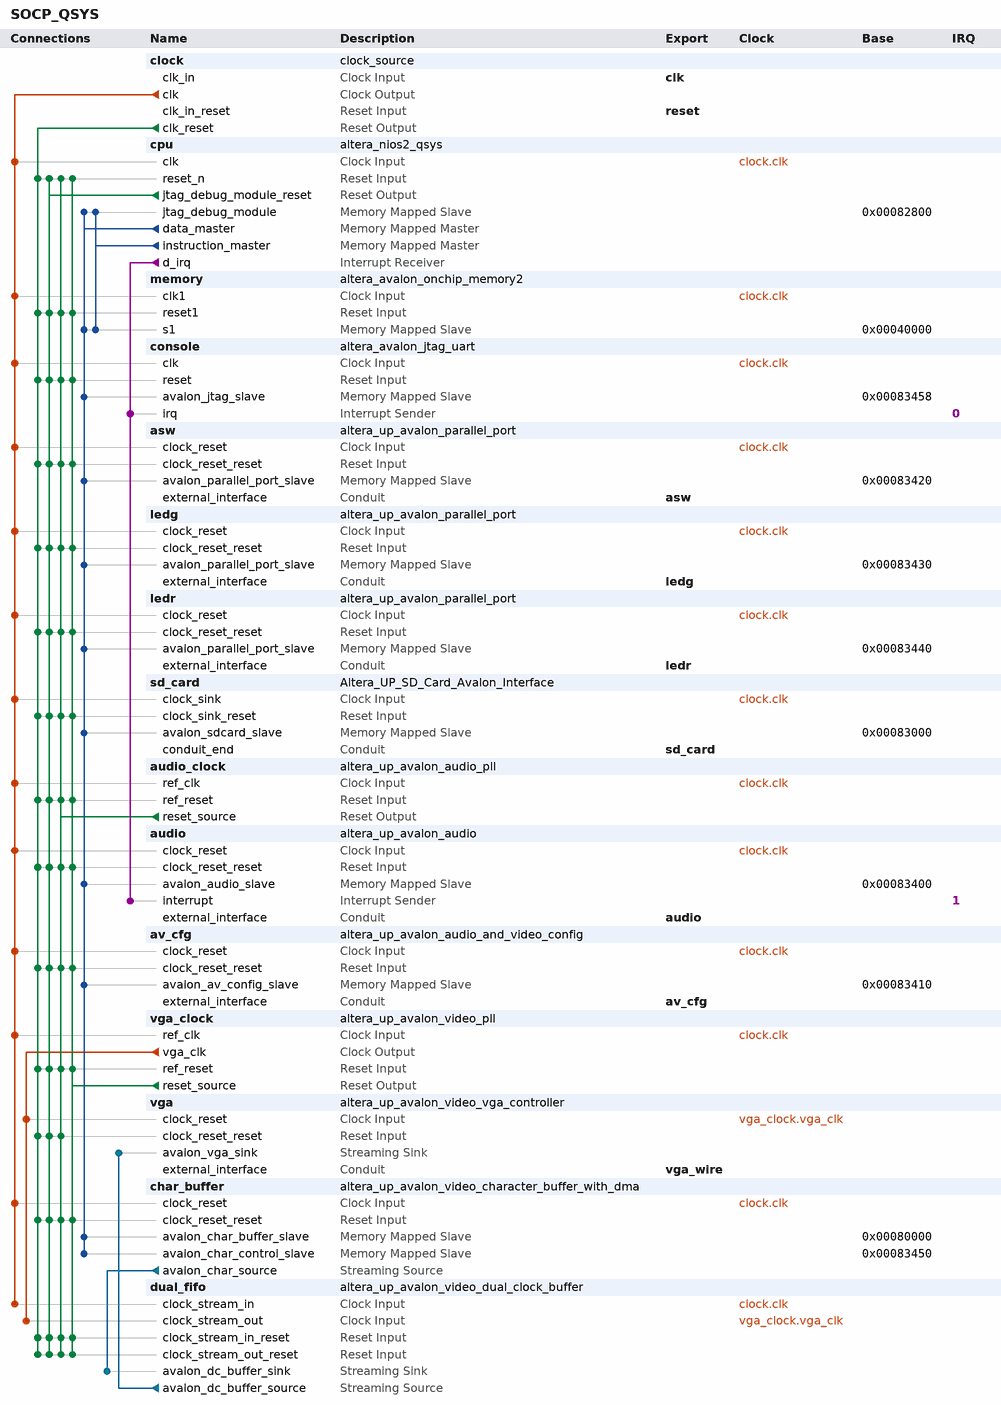
[diagram p0: system contents]
# Platform Designer (Qsys) system SOCP_QSYS, Cyclone IV E EP4CE115F29C7
# Parameters at their usual value, and those the tool derives, are not listed.
package require -exact qsys 13.1
create_system SOCP_QSYS
set_project_property DEVICE_FAMILY {Cyclone IV E}
set_project_property DEVICE EP4CE115F29C7

add_instance clock clock_source 14.0
set_instance_parameter_value clock clockFrequency 50000000

add_instance cpu altera_nios2_qsys 14.0
set_instance_parameter_value cpu resetrequest_enabled true
set_instance_parameter_value cpu resetSlave memory.s1
set_instance_parameter_value cpu mmu_TLBMissExcSlave None
set_instance_parameter_value cpu exceptionSlave memory.s1
set_instance_parameter_value cpu breakSlave cpu.jtag_debug_module
set_instance_parameter_value cpu impl Fast
set_instance_parameter_value cpu icache_size 4096

add_instance memory altera_avalon_onchip_memory2 14.0
set_instance_parameter_value memory dataWidth 32
set_instance_parameter_value memory dualPort false
set_instance_parameter_value memory initMemContent true
set_instance_parameter_value memory initializationFileName onchip_mem.hex
set_instance_parameter_value memory memorySize 196608

add_instance console altera_avalon_jtag_uart 14.0
set_instance_parameter_value console simInteractiveOptions NO_INTERACTIVE_WINDOWS

add_instance asw altera_up_avalon_parallel_port 13.1
set_instance_parameter_value asw board DE2-115
set_instance_parameter_value asw preset {Slider Switches}
set_instance_parameter_value asw capture false
set_instance_parameter_value asw edge Rising
set_instance_parameter_value asw irq false

add_instance ledg altera_up_avalon_parallel_port 13.1
set_instance_parameter_value ledg board DE2-115
set_instance_parameter_value ledg preset LEDs
set_instance_parameter_value ledg capture false
set_instance_parameter_value ledg edge Rising
set_instance_parameter_value ledg irq false

add_instance ledr altera_up_avalon_parallel_port 13.1
set_instance_parameter_value ledr board DE2-115
set_instance_parameter_value ledr preset LEDs
set_instance_parameter_value ledr leds Red
set_instance_parameter_value ledr capture false
set_instance_parameter_value ledr edge Rising
set_instance_parameter_value ledr irq false

add_instance sd_card Altera_UP_SD_Card_Avalon_Interface 13.1

add_instance audio_clock altera_up_avalon_audio_pll 13.1
set_instance_parameter_value audio_clock gui_refclk 50.0

add_instance audio altera_up_avalon_audio 13.1
set_instance_parameter_value audio avalon_bus_type {Memory Mapped}
set_instance_parameter_value audio audio_in true
set_instance_parameter_value audio dw 32

add_instance av_cfg altera_up_avalon_audio_and_video_config 13.1
set_instance_parameter_value av_cfg board DE2-115
set_instance_parameter_value av_cfg audio_in {Line In to ADC}
set_instance_parameter_value av_cfg dac_enable false
set_instance_parameter_value av_cfg line_in_bypass true
set_instance_parameter_value av_cfg bit_length 32
set_instance_parameter_value av_cfg sampling_rate {48 kHz}

add_instance vga_clock altera_up_avalon_video_pll 13.1
set_instance_parameter_value vga_clock gui_refclk 50.0
set_instance_parameter_value vga_clock camera {5MP Digital Camera}
set_instance_parameter_value vga_clock lcd {7" LCD on VEEK-MT and MTL Module}

add_instance vga altera_up_avalon_video_vga_controller 13.1
set_instance_parameter_value vga board DE2-115
set_instance_parameter_value vga resolution {VGA 640x480}

add_instance char_buffer altera_up_avalon_video_character_buffer_with_dma 13.1
set_instance_parameter_value char_buffer enable_transparency false

add_instance dual_fifo altera_up_avalon_video_dual_clock_buffer 13.1
set_instance_parameter_value dual_fifo color_bits 10

# connections
add_connection clock.clk asw.clock_reset clock
add_connection clock.clk audio.clock_reset clock
add_connection clock.clk audio_clock.ref_clk clock
add_connection clock.clk av_cfg.clock_reset clock
add_connection clock.clk char_buffer.clock_reset clock
add_connection clock.clk console.clk clock
add_connection clock.clk cpu.clk clock
add_connection clock.clk dual_fifo.clock_stream_in clock
add_connection clock.clk ledg.clock_reset clock
add_connection clock.clk ledr.clock_reset clock
add_connection clock.clk memory.clk1 clock
add_connection clock.clk sd_card.clock_sink clock
add_connection clock.clk vga_clock.ref_clk clock
add_connection vga_clock.vga_clk dual_fifo.clock_stream_out clock
add_connection vga_clock.vga_clk vga.clock_reset clock
add_connection audio_clock.reset_source asw.clock_reset_reset reset
add_connection audio_clock.reset_source audio.clock_reset_reset reset
add_connection audio_clock.reset_source audio_clock.ref_reset reset
add_connection audio_clock.reset_source av_cfg.clock_reset_reset reset
add_connection audio_clock.reset_source char_buffer.clock_reset_reset reset
add_connection audio_clock.reset_source console.reset reset
add_connection audio_clock.reset_source cpu.reset_n reset
add_connection audio_clock.reset_source dual_fifo.clock_stream_in_reset reset
add_connection audio_clock.reset_source dual_fifo.clock_stream_out_reset reset
add_connection audio_clock.reset_source ledg.clock_reset_reset reset
add_connection audio_clock.reset_source ledr.clock_reset_reset reset
add_connection audio_clock.reset_source memory.reset1 reset
add_connection audio_clock.reset_source sd_card.clock_sink_reset reset
add_connection audio_clock.reset_source vga.clock_reset_reset reset
add_connection audio_clock.reset_source vga_clock.ref_reset reset
add_connection clock.clk_reset asw.clock_reset_reset reset
add_connection clock.clk_reset audio.clock_reset_reset reset
add_connection clock.clk_reset audio_clock.ref_reset reset
add_connection clock.clk_reset av_cfg.clock_reset_reset reset
add_connection clock.clk_reset char_buffer.clock_reset_reset reset
add_connection clock.clk_reset console.reset reset
add_connection clock.clk_reset cpu.reset_n reset
add_connection clock.clk_reset dual_fifo.clock_stream_in_reset reset
add_connection clock.clk_reset dual_fifo.clock_stream_out_reset reset
add_connection clock.clk_reset ledg.clock_reset_reset reset
add_connection clock.clk_reset ledr.clock_reset_reset reset
add_connection clock.clk_reset memory.reset1 reset
add_connection clock.clk_reset sd_card.clock_sink_reset reset
add_connection clock.clk_reset vga.clock_reset_reset reset
add_connection clock.clk_reset vga_clock.ref_reset reset
add_connection cpu.jtag_debug_module_reset asw.clock_reset_reset reset
add_connection cpu.jtag_debug_module_reset audio.clock_reset_reset reset
add_connection cpu.jtag_debug_module_reset audio_clock.ref_reset reset
add_connection cpu.jtag_debug_module_reset av_cfg.clock_reset_reset reset
add_connection cpu.jtag_debug_module_reset char_buffer.clock_reset_reset reset
add_connection cpu.jtag_debug_module_reset console.reset reset
add_connection cpu.jtag_debug_module_reset cpu.reset_n reset
add_connection cpu.jtag_debug_module_reset dual_fifo.clock_stream_in_reset reset
add_connection cpu.jtag_debug_module_reset dual_fifo.clock_stream_out_reset reset
add_connection cpu.jtag_debug_module_reset ledg.clock_reset_reset reset
add_connection cpu.jtag_debug_module_reset ledr.clock_reset_reset reset
add_connection cpu.jtag_debug_module_reset memory.reset1 reset
add_connection cpu.jtag_debug_module_reset sd_card.clock_sink_reset reset
add_connection cpu.jtag_debug_module_reset vga.clock_reset_reset reset
add_connection cpu.jtag_debug_module_reset vga_clock.ref_reset reset
add_connection vga_clock.reset_source asw.clock_reset_reset reset
add_connection vga_clock.reset_source audio.clock_reset_reset reset
add_connection vga_clock.reset_source audio_clock.ref_reset reset
add_connection vga_clock.reset_source av_cfg.clock_reset_reset reset
add_connection vga_clock.reset_source char_buffer.clock_reset_reset reset
add_connection vga_clock.reset_source console.reset reset
add_connection vga_clock.reset_source cpu.reset_n reset
add_connection vga_clock.reset_source dual_fifo.clock_stream_in_reset reset
add_connection vga_clock.reset_source dual_fifo.clock_stream_out_reset reset
add_connection vga_clock.reset_source ledg.clock_reset_reset reset
add_connection vga_clock.reset_source ledr.clock_reset_reset reset
add_connection vga_clock.reset_source memory.reset1 reset
add_connection vga_clock.reset_source sd_card.clock_sink_reset reset
add_connection vga_clock.reset_source vga_clock.ref_reset reset
add_connection cpu.data_master asw.avalon_parallel_port_slave avalon
set_connection_parameter_value cpu.data_master/asw.avalon_parallel_port_slave baseAddress 0x00083420
add_connection cpu.data_master audio.avalon_audio_slave avalon
set_connection_parameter_value cpu.data_master/audio.avalon_audio_slave baseAddress 0x00083400
add_connection cpu.data_master av_cfg.avalon_av_config_slave avalon
set_connection_parameter_value cpu.data_master/av_cfg.avalon_av_config_slave baseAddress 0x00083410
add_connection cpu.data_master char_buffer.avalon_char_buffer_slave avalon
set_connection_parameter_value cpu.data_master/char_buffer.avalon_char_buffer_slave baseAddress 0x00080000
add_connection cpu.data_master char_buffer.avalon_char_control_slave avalon
set_connection_parameter_value cpu.data_master/char_buffer.avalon_char_control_slave baseAddress 0x00083450
add_connection cpu.data_master console.avalon_jtag_slave avalon
set_connection_parameter_value cpu.data_master/console.avalon_jtag_slave baseAddress 0x00083458
add_connection cpu.data_master cpu.jtag_debug_module avalon
set_connection_parameter_value cpu.data_master/cpu.jtag_debug_module baseAddress 0x00082800
add_connection cpu.data_master ledg.avalon_parallel_port_slave avalon
set_connection_parameter_value cpu.data_master/ledg.avalon_parallel_port_slave baseAddress 0x00083430
add_connection cpu.data_master ledr.avalon_parallel_port_slave avalon
set_connection_parameter_value cpu.data_master/ledr.avalon_parallel_port_slave baseAddress 0x00083440
add_connection cpu.data_master memory.s1 avalon
set_connection_parameter_value cpu.data_master/memory.s1 baseAddress 0x00040000
add_connection cpu.data_master sd_card.avalon_sdcard_slave avalon
set_connection_parameter_value cpu.data_master/sd_card.avalon_sdcard_slave baseAddress 0x00083000
add_connection cpu.instruction_master cpu.jtag_debug_module avalon
set_connection_parameter_value cpu.instruction_master/cpu.jtag_debug_module baseAddress 0x00082800
add_connection cpu.instruction_master memory.s1 avalon
set_connection_parameter_value cpu.instruction_master/memory.s1 baseAddress 0x00040000
add_connection char_buffer.avalon_char_source dual_fifo.avalon_dc_buffer_sink avalon_streaming
add_connection dual_fifo.avalon_dc_buffer_source vga.avalon_vga_sink avalon_streaming
add_connection cpu.d_irq audio.interrupt interrupt
set_connection_parameter_value cpu.d_irq/audio.interrupt irqNumber 1
add_connection cpu.d_irq console.irq interrupt
set_connection_parameter_value cpu.d_irq/console.irq irqNumber 0

# exported interfaces
add_interface clk clock sink
set_interface_property clk EXPORT_OF clock.clk_in
add_interface reset reset sink
set_interface_property reset EXPORT_OF clock.clk_in_reset
add_interface asw conduit end
set_interface_property asw EXPORT_OF asw.external_interface
add_interface ledg conduit end
set_interface_property ledg EXPORT_OF ledg.external_interface
add_interface ledr conduit end
set_interface_property ledr EXPORT_OF ledr.external_interface
add_interface sd_card conduit end
set_interface_property sd_card EXPORT_OF sd_card.conduit_end
add_interface audio conduit end
set_interface_property audio EXPORT_OF audio.external_interface
add_interface av_cfg conduit end
set_interface_property av_cfg EXPORT_OF av_cfg.external_interface
add_interface vga_wire conduit end
set_interface_property vga_wire EXPORT_OF vga.external_interface

set_interconnect_requirement {$system} qsys_mm.clockCrossingAdapter HANDSHAKE
set_interconnect_requirement {$system} qsys_mm.maxAdditionalLatency 1
set_interconnect_requirement {$system} qsys_mm.insertDefaultSlave FALSE

save_system SOCP_QSYS.qsys
